# Altium schematic sheet HTMD-PREAMP2.SCHDOC: EMRT PRE-AMP
size A1; DocumentNumber: 9321-E-1210 EMRT PRE-AMP; Revision: 2.0; SheetNumber: 1; SheetTotal: 1; Author: CFB; DrawnBy: CFB; PageSetup: Record=PageOptions|CenterHorizontal=True|CenterVertical=True|PrintScale=0.52|XCorrection=1.00|YCorrection=1.00|PrintKind=1|BorderSize=5000000|LeftOffset=0|BottomOffset=0|Orientation=2|PaperLength=1000|PaperWidth=1000|Scale=100|PaperSource=15|PrintQuality=600|MediaType=1|DitherType=10|PaperKind=A3|PrintScaleMode=1
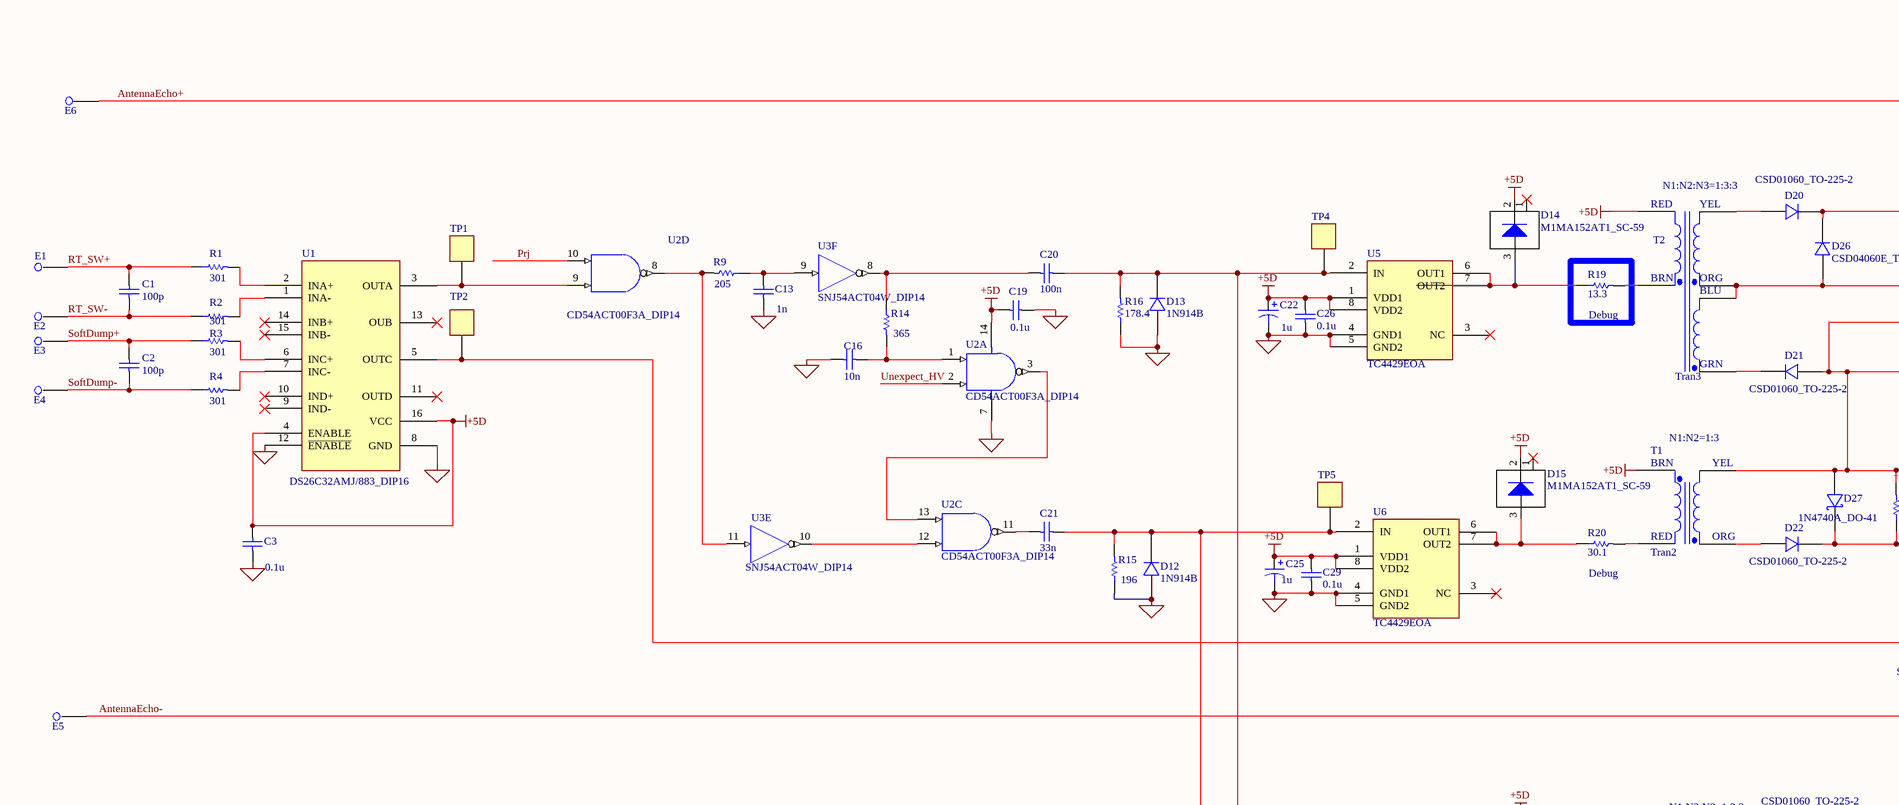
[diagram p0: HTMD-PREAMP2.SCHDOC, top left]
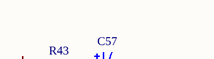
[diagram p1: HTMD-PREAMP2.SCHDOC, top right]
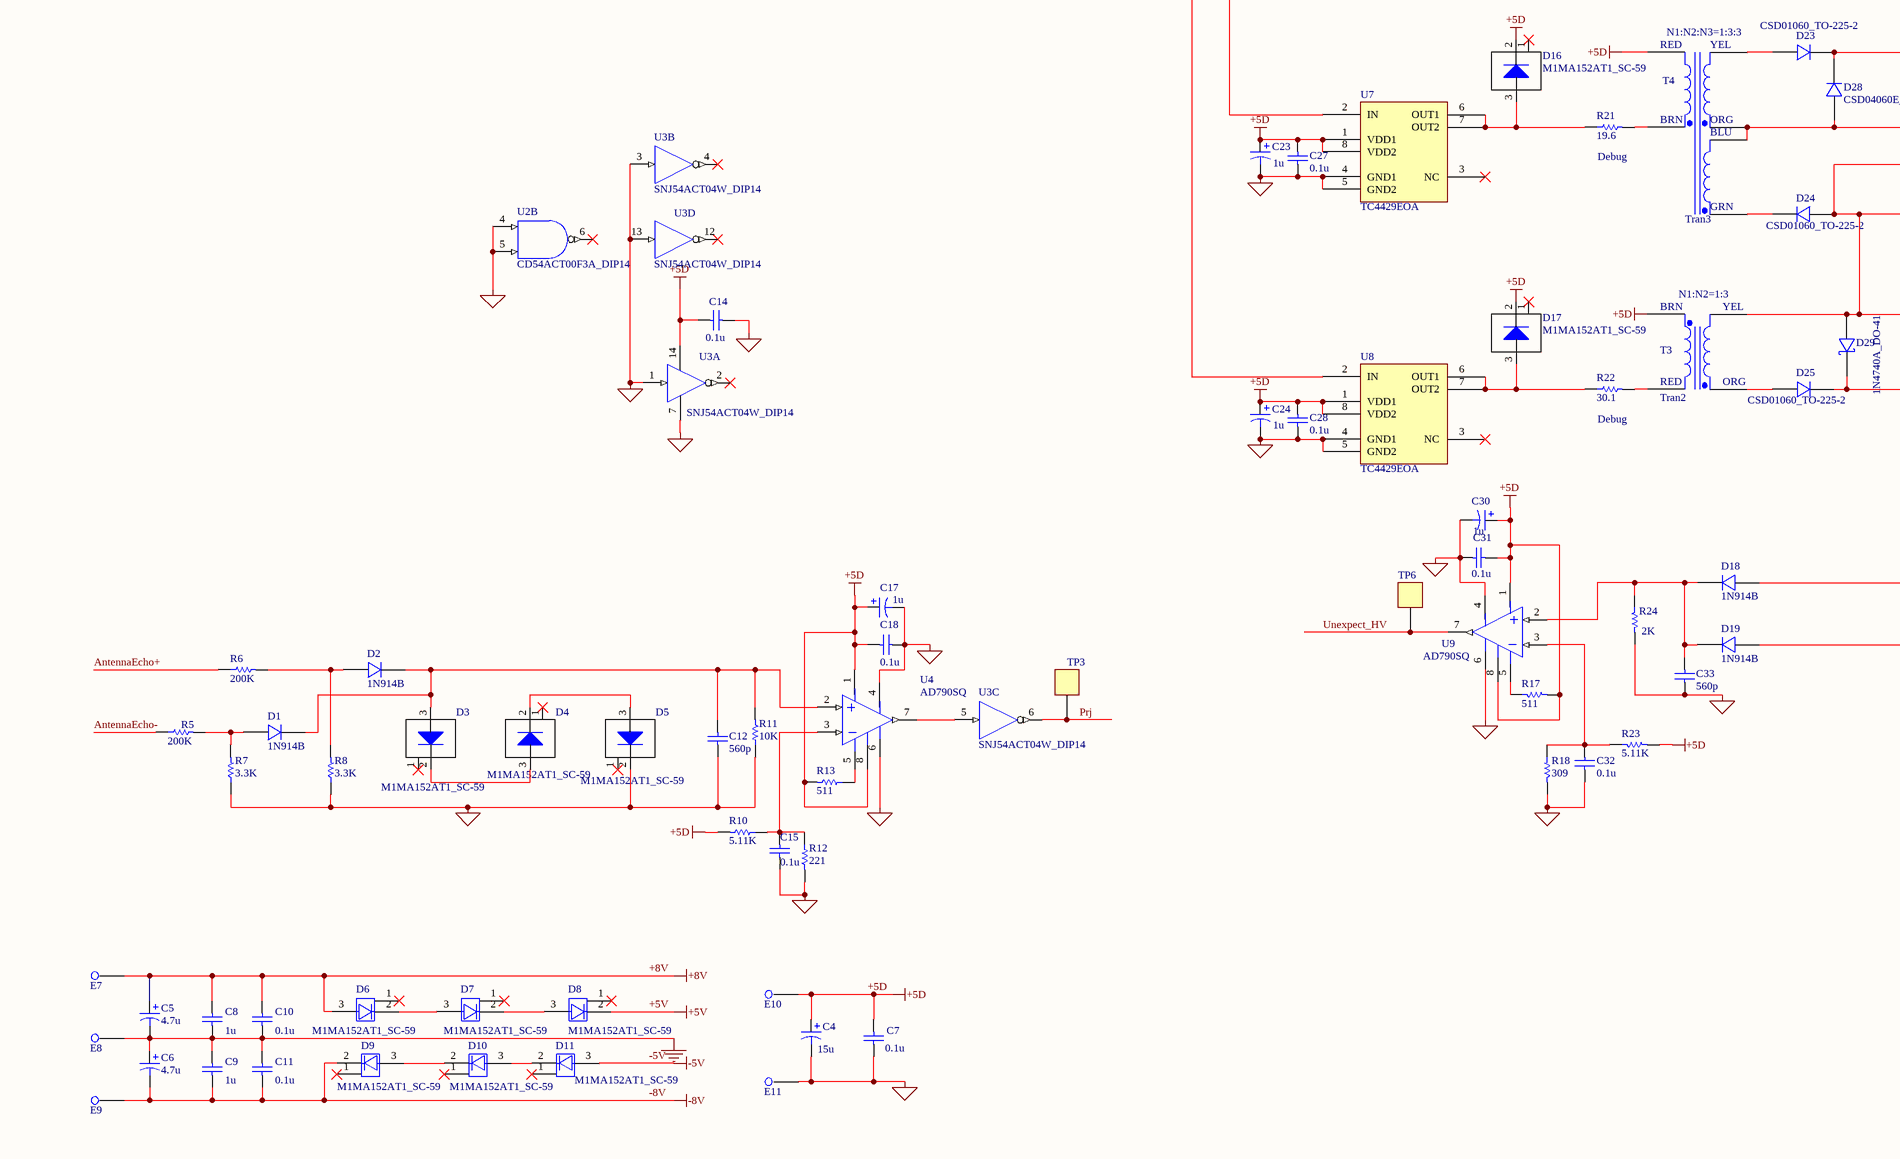
[diagram p2: HTMD-PREAMP2.SCHDOC, bottom left]
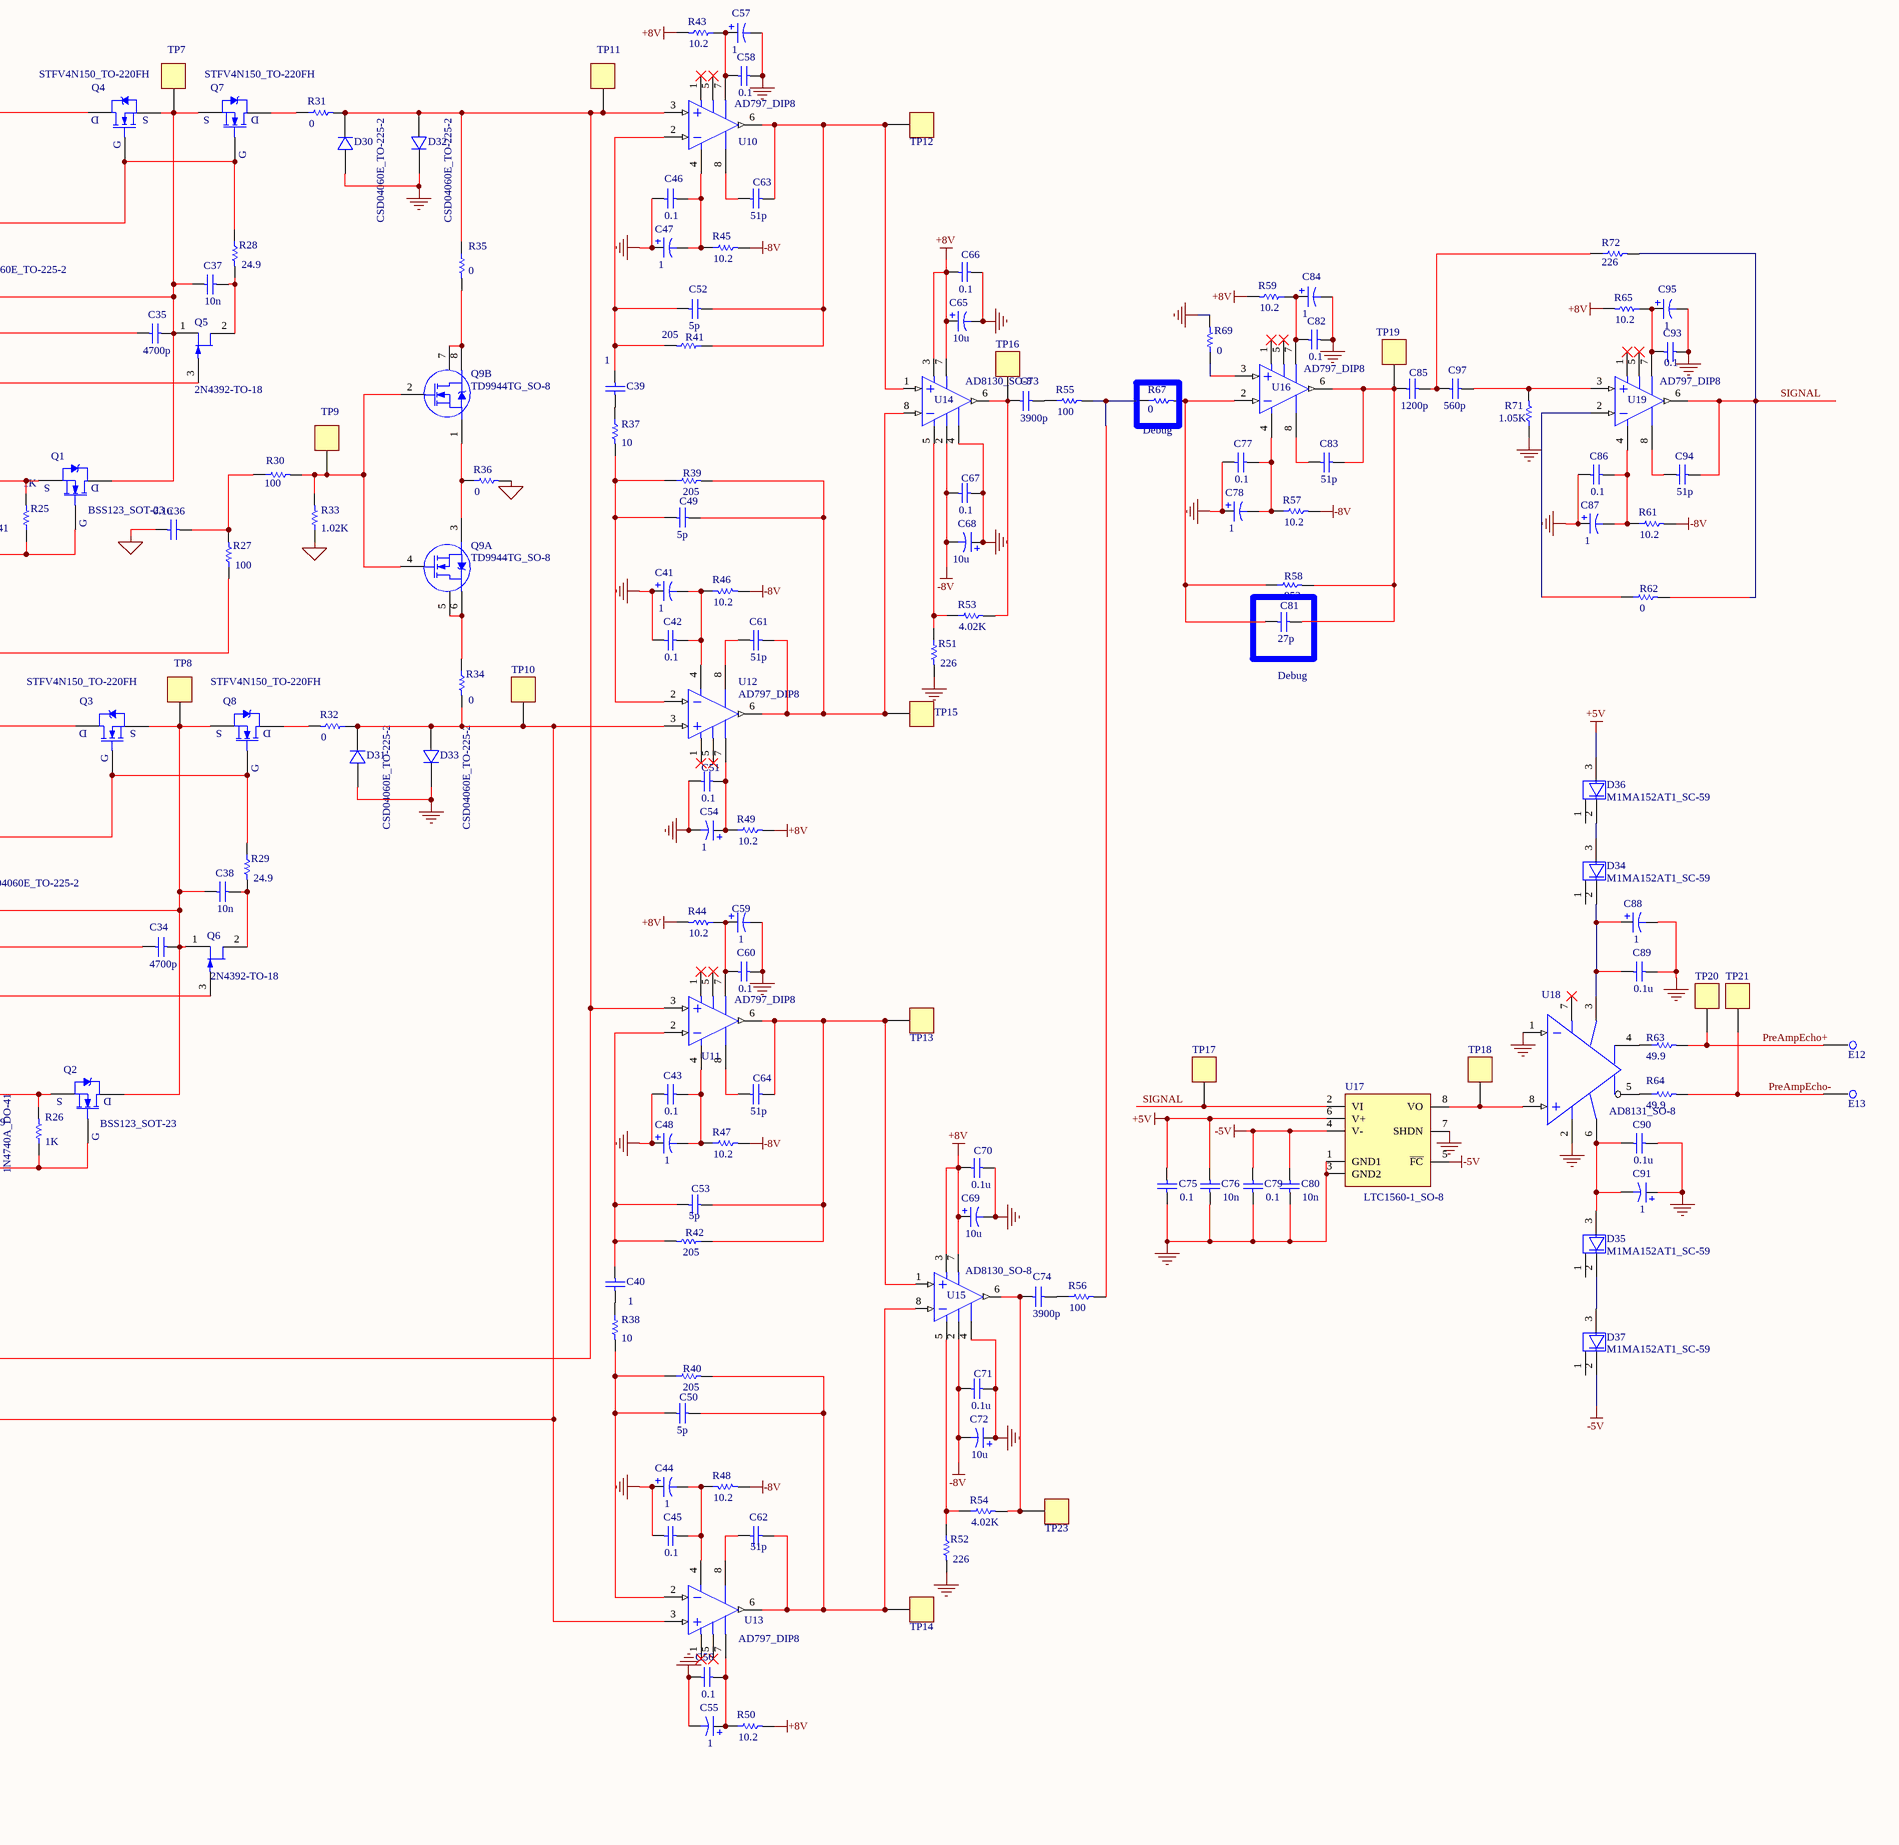
[diagram p3: HTMD-PREAMP2.SCHDOC, bottom right]

## Parts
C1  100p  [C0805]
C2  100p  [C0805]
C3  0.1u  [C0805]
C4  15u  [595D]
C5  4.7u  [595D]
C6  4.7u  [595D]
C7  0.1u  [C0805]
C8  1u  [1206]
C9  1u  [1206]
C10  0.1u  [C0805]
C11  0.1u  [C0805]
C12  560p  [C0805]
C13  1n  [1206]
C14  0.1u  [C0805]
C15  0.1u  [C0805]
C16  10n  [C0805]
C17  1u  [C1206]
C18  0.1u  [C0805]
C19  0.1u  [C0805]
C20  100n  [C0805]
C21  33n  [1206]
C22  1u  [C1206]
C23  1u  [C1206]
C24  1u  [C1206]
C25  1u  [C1206]
C26  0.1u  [C0805]
C27  0.1u  [C0805]
C28  0.1u  [C0805]
C29  0.1u  [C0805]
C30  1u  [C1206]
C31  0.1u  [C0805]
C32  0.1u  [C0805]
C33  560p  [C0805]
C34  4700p  [C0805]
C35  4700p  [C0805]
C36  0.1u  [C0805]
C37  10n  [1206]
C38  10n  [1206]
C39  1  [1206]
C40  1  [1206]
C41  1  [C1206]
C42  0.1  [C0805]
C43  0.1  [C0805]
C44  1  [C1206]
C45  0.1  [C0805]
C46  0.1  [C0805]
C47  1  [C1206]
C48  1  [C1206]
C49  5p  [C0805]
C50  5p  [C0805]
C51  0.1  [C0805]
C52  5p  [C0805]
C53  5p  [C0805]
C54  1  [C1206]
C55  1  [C1206]
C56  0.1  [C0805]
C57  1  [C1206]
C58  0.1  [C0805]
C59  1  [C1206]
C60  0.1  [C0805]
C61  51p  [C0805]
C62  51p  [C0805]
C63  51p  [C0805]
C64  51p  [C0805]
C65  10u  [7343]
C66  0.1  [C0805]
C67  0.1  [C0805]
C68  10u  [7343]
C69  10u  [7343]
C70  0.1u  [C0805]
C71  0.1u  [C0805]
C72  10u  [7343]
C73  3900p  [1206]
C74  3900p  [1206]
C75  0.1  [C0805]
C76  10n  [C0805]
C77  0.1  [C0805]
C78  1  [C1206]
C79  0.1  [C0805]
C80  10n  [C0805]
C81  27p  [C0805]
C82  0.1  [C0805]
C83  51p  [C0805]
C84  1  [C1206]
C85  1200p  [C0805]
C86  0.1  [C0805]
C87  1  [C1206]
C88  1  [C1206]
C89  0.1u  [C0805]
C90  0.1u  [C0805]
C91  1  [C1206]
C93  0.1  [C0805]
C94  51p  [C0805]
C95  1  [C1206]
C97  560p  [C0805]
D1  1N914B  [DO-35]
D2  1N914B  [DO-35]
D3  M1MA152AT1_SC-59  [SC-59]
D4  M1MA152AT1_SC-59  [SC-59]
D5  M1MA152AT1_SC-59  [SC-59]
D6  M1MA152AT1_SC-59  [SC-59]
D7  M1MA152AT1_SC-59  [SC-59]
D8  M1MA152AT1_SC-59  [SC-59]
D9  M1MA152AT1_SC-59  [SC-59]
D10  M1MA152AT1_SC-59  [SC-59]
D11  M1MA152AT1_SC-59  [SC-59]
D12  1N914B  [DO-35]
D13  1N914B  [DO-35]
D14  M1MA152AT1_SC-59  [SC-59]
D15  M1MA152AT1_SC-59  [SC-59]
D16  M1MA152AT1_SC-59  [SC-59]
D17  M1MA152AT1_SC-59  [SC-59]
D18  1N914B  [DO-35]
D19  1N914B  [DO-35]
D20  CSD01060_TO-225-2  [TO-225-2]
D21  CSD01060_TO-225-2  [TO-225-2]
D22  CSD01060_TO-225-2  [TO-225-2]
D23  CSD01060_TO-225-2  [TO-225-2]
D24  CSD01060_TO-225-2  [TO-225-2]
D25  CSD01060_TO-225-2  [TO-225-2]
D26  CSD04060E_TO-225-2  [TO-225-2]
D27  1N4740A_DO-41  [DO-41]
D28  CSD04060E_TO-225-2  [TO-225-2]
D29  1N4740A_DO-41  [DO-41]
D30  CSD04060E_TO-225-2  [TO-225-2]
D31  CSD04060E_TO-225-2  [TO-225-2]
D32  CSD04060E_TO-225-2  [TO-225-2]
D33  CSD04060E_TO-225-2  [TO-225-2]
D34  M1MA152AT1_SC-59  [SC-59]
D35  M1MA152AT1_SC-59  [SC-59]
D36  M1MA152AT1_SC-59  [SC-59]
D37  M1MA152AT1_SC-59  [SC-59]
E1  InOut  [TermSignal]  (value not drawn)
E2  InOut  [TermSignal]  (value not drawn)
E3  InOut  [TermSignal]  (value not drawn)
E4  InOut  [TermSignal]  (value not drawn)
E5  InOut  [TermSignal]  (value not drawn)
E6  InOut  [TermSignal]  (value not drawn)
E7  InOut  [TermPower]  (value not drawn)
E8  InOut  [TermPower]  (value not drawn)
E9  InOut  [TermPower]  (value not drawn)
E10  InOut  [TermPower]  (value not drawn)
E11  InOut  [TermPower]  (value not drawn)
E12  InOut  [TermSignal]  (value not drawn)
E13  InOut  [TermSignal]  (value not drawn)
Q1  BSS123_SOT-23  [SOT-23]
Q2  BSS123_SOT-23  [SOT-23]
Q3  STFV4N150_TO-220FH  [TO-220FH]
Q4  STFV4N150_TO-220FH  [TO-220FH]
Q5  2N4392-TO-18  [TO-18]
Q6  2N4392-TO-18  [TO-18]
Q7  STFV4N150_TO-220FH  [TO-220FH]
Q8  STFV4N150_TO-220FH  [TO-220FH]
Q9  TD9944TG_SO-8  [SO-8]  (parts A,B of 2)
R1  301  [R0805]
R2  301  [R0805]
R3  301  [R0805]
R4  301  [R0805]
R5  200K  [MG680]
R6  200K  [MG680]
R7  3.3K  [2010]
R8  3.3K  [2010]
R9  205  [R0805]
R10  5.11K  [R0805]
R11  10K  [R1206]
R12  221  [R0805]
R13  511  [R0805]
R14  365  [R0805]
R15  196  [R0805]
R16  178.4  [R0805]
R17  511  [R0805]
R18  309  [R0805]
R19  13.3  [R0805]
R20  30.1  [R0805]
R21  19.6  [R0805]
R22  30.1  [R0805]
R23  5.11K  [R0805]
R24  2K  [R1206]
R25  1K  [R0805]
R26  1K  [R0805]
R27  100  [R0805]
R28  24.9  [R0805]
R29  24.9  [R0805]
R30  100  [R0805]
R31  0  [R0805]
R32  0  [R0805]
R33  1.02K  [R0805]
R34  0  [R0805]
R35  0  [R0805]
R36  0  [R0805]
R37  10  [R0805]
R38  10  [R0805]
R39  205  [R0805]
R40  205  [R0805]
R41  205  [R0805]
R42  205  [R0805]
R43  10.2  [R0805]
R44  10.2  [R0805]
R45  10.2  [R0805]
R46  10.2  [R0805]
R47  10.2  [R0805]
R48  10.2  [R0805]
R49  10.2  [R0805]
R50  10.2  [R0805]
R51  226  [R0805]
R52  226  [R0805]
R53  4.02K  [R0805]
R54  4.02K  [R0805]
R55  100  [R0805]
R56  100  [R0805]
R57  10.2  [R0805]
R58  953  [R0805]
R59  10.2  [R0805]
R61  10.2  [R0805]
R62  0  [R0805]
R63  49.9  [R0805]
R64  49.9  [R0805]
R65  10.2  [R0805]
R67  0  [R0805]
R69  0  [R0805]
R71  1.05K  [R0805]
R72  226  [R0805]
T1  Tran2  [Tran2]
T2  Tran3  [Tran3]
T3  Tran2  [Tran2]
T4  Tran3  [Tran3]
TP1  TestPoint  [test_small]  (value not drawn)
TP2  TestPoint  [test_small]  (value not drawn)
TP3  TestPoint  [test_small]  (value not drawn)
TP4  TestPoint  [test_small]  (value not drawn)
TP5  TestPoint  [test_small]  (value not drawn)
TP6  TestPoint  [test_small]  (value not drawn)
TP7  TestPoint  [test_small]  (value not drawn)
TP8  TestPoint  [test_small]  (value not drawn)
TP9  TestPoint  [test_small]  (value not drawn)
TP10  TestPoint  [test_small]  (value not drawn)
TP11  TestPoint  [test_small]  (value not drawn)
TP12  TestPoint  [test_small]  (value not drawn)
TP13  TestPoint  [test_small]  (value not drawn)
TP14  TestPoint  [test_small]  (value not drawn)
TP15  TestPoint  [test_small]  (value not drawn)
TP16  TestPoint  [test_small]  (value not drawn)
TP17  TestPoint  [test_small]  (value not drawn)
TP18  TestPoint  [test_small]  (value not drawn)
TP19  TestPoint  [test_small]  (value not drawn)
TP20  TestPoint  [test_small]  (value not drawn)
TP21  TestPoint  [test_small]  (value not drawn)
TP23  TestPoint  [test_small]  (value not drawn)
U1  DS26C32AMJ/883_DIP16  [DIP16]
U2  CD54ACT00F3A_DIP14  [DIP14]  (parts A,B,C,D of 4)
U3  SNJ54ACT04W_DIP14  [DIP14]  (parts A,B,C,D,E,F of 6)
U4  AD790SQ  [DIP8]
U5  TC4429EOA  [SO-8]
U6  TC4429EOA  [SO-8]
U7  TC4429EOA  [SO-8]
U8  TC4429EOA  [SO-8]
U9  AD790SQ  [DIP8]
U10  AD797_DIP8  [DIP8]
U11  AD797_DIP8  [DIP8]
U12  AD797_DIP8  [DIP8]
U13  AD797_DIP8  [DIP8]
U14  AD8130_SO-8  [SO-8]
U15  AD8130_SO-8  [SO-8]
U16  AD797_DIP8  [DIP8]
U17  LTC1560-1_SO-8  [SO-8]
U18  AD8131_SO-8  [SO-8]
U19  AD797_DIP8  [DIP8]

## Blocks framed on the sheet
Debug: R19

## Nets
+5D: C3.1 C4.1 C7.2 C14.2 C17.1 C18.1 C19.2 C22.1 C23.1 C24.1 C25.1 C26.2 C27.2 C28.2 C29.2 C30.1 C31.1 D14.2 D15.2 D16.2 D17.2 E10.1(NC) R10.2 R13.2 R17.2 R23.2 T1.4(Pri-) T2.6(Pri+) T3.4(Pri-) T4.6(Pri+) U1.4(ENABLE) U1.16(VCC) U2.14(Vcc) U3.14(Vcc) U4.1(+Vs) U4.8(Vlogic) U5.1(VDD1) U5.8(VDD2) U6.1(VDD1) U6.8(VDD2) U7.1(VDD1) U7.8(VDD2) U8.1(VDD1) U8.8(VDD2) U9.1(+Vs) U9.8(Vlogic)
+5V: C75.1 C76.1 D8.2(K) D36.3(A) U17.6(V+)
+8V: C5.1 C8.1 C10.1 C65.1 C66.2 C69.1 C70.2 D6.3(A) E7.1(NC) R43.2 R44.2 R49.2 R50.2 R59.2 R65.2 U14.3(~{PD}) U14.7(+VS) U15.3(~{PD}) U15.7(+VS)
-5V: C79.1 C80.1 D11.3(A) D37.2(K) U17.4(V-) U17.5(~{FC})
-8V: C6.2 C9.2 C11.1 C67.2 C68.2 C71.2 C72.2 D9.2(K) E9.1(NC) R45.2 R46.2 R47.2 R48.2 R57.2 R61.2 U14.2(-VS) U15.2(-VS)
AGND: C5.2 C6.1 C8.2 C9.1 C10.2 C11.2 C41.1 C42.1 C43.1 C44.1 C45.2 C46.1 C47.1 C48.1 C51.2 C54.2 C55.2 C56.2 C57.2 C58.2 C59.2 C60.2 C65.2 C66.1 C67.1 C68.1 C69.2 C70.1 C71.1 C72.1 C75.2 C76.2 C77.1 C78.1 C79.2 C80.2 C82.2 C84.2 C86.1 C87.1 C88.2 C89.2 C90.1 C91.1 C93.2 C95.2 D30.2(A) D31.2(A) D32.1(K) D33.1(K) E8.1(NC) R51.2 R52.2 R69.2 R71.1 U14.4(REF) U15.4(REF) U17.1(GND1) U17.3(GND2) U17.7(SHDN) U18.1(Din-) U18.2(Vcom)
DGND: C3.2 C4.2 C7.1 C12.1 C13.2 C14.1 C15.1 C16.2 C17.2 C18.2 C19.1 C22.2 C23.2 C24.2 C25.2 C26.1 C27.1 C28.1 C29.1 C30.2 C31.2 C32.1 C33.1 C36.2 D5.2 D12.1(A) D13.1(A) E11.1(NC) R7.1 R8.1 R11.1 R12.2 R15.1 R16.1 R18.2 R24.2 R33.1 R36.2 U1.8(GND) U1.12(~{ENABLE}) U2.4(A) U2.5(B) U2.7(GND) U3.1(A) U3.3(A) U3.7(GND) U3.13(A) U4.4(-Vs) U4.6(GND) U5.4(GND1) U5.5(GND2) U6.4(GND1) U6.5(GND2) U7.4(GND1) U7.5(GND2) U8.4(GND1) U8.5(GND2) U9.4(-Vs) U9.6(GND)
AntennaEcho+: E6.1(NC) Q4.2(D) R6.1
AntennaEcho-: E5.1(NC) Q3.2(D) R5.1
PreAmpEcho+: E12.1(NC) R63.2 TP20.1(NC)
PreAmpEcho-: E13.1(NC) R64.2 TP21.1(NC)
Prj: TP3.1(NC) U2.10(A) U3.6(~{O})
RT_SW+: C1.2 E1.1(NC) R1.1
RT_SW-: C1.1 E2.1(NC) R2.1
SIGNAL: C94.1 R62.2 R72.2 TP17.1(NC) U17.2(VI) U19.6(OUTPUT)
SoftDump+: C2.2 E3.1(NC) R3.1
SoftDump-: C2.1 E4.1(NC) R4.1
Unexpect_HV: TP6.1(NC) U2.2(B) U9.7(OUT)
NetC12_2: C12.2 D1.2(K) D2.2(K) D3.3(A) R11.2 U4.2(IN+)
NetC13_1: C13.1 R9.1 U3.9(A)
NetC15_2: C15.2 R10.1 R12.1 U4.3(IN-)
NetC16_1: C16.1 R14.2 U2.1(A)
NetC20_1: C20.1 R14.1 U3.8(~{O})
NetC20_2: C20.2 D13.2(K) R16.2 TP4.1(NC) U5.2(IN) U7.2(IN)
NetC21_1: C21.1 U2.11(~{O})
NetC21_2: C21.2 D12.2(K) R15.2 TP5.1(NC) U6.2(IN) U8.2(IN)
NetC32_2: C32.2 R18.1 R23.1 U9.3(IN-)
NetC33_2: C33.2 D18.2(K) D19.2(K) R24.1 U9.2(IN+)
NetC34_1: C34.1 D24.2(A) D29.1(A) Q2.2(S) Q6.3(G) R26.2 T3.1(Sec+)
NetC34_2: C34.2 C38.1 D28.2(A) Q2.3(D) Q3.3(S) Q6.1(D) Q8.3(S) T4.2(Sec2+) T4.5(Sec1-) TP8.1(NC)
NetC35_1: C35.1 D21.2(A) D27.1(A) Q1.2(S) Q5.3(G) R25.2 T1.1(Sec+)
NetC35_2: C35.2 C37.1 D26.2(A) Q1.3(D) Q4.3(S) Q5.1(D) Q7.3(S) T2.2(Sec2+) T2.5(Sec1-) TP7.1(NC)
NetC36_1: C36.1 R27.2 R30.1
NetC37_2: C37.2 Q5.2(S) R28.2
NetC38_2: C38.2 Q6.2(S) R29.2
NetC39_1: C39.1 R37.1
NetC39_2: C39.2 C52.2 R41.2 U10.2(-IN)
NetC40_1: C40.1 R38.1
NetC40_2: C40.2 C53.2 R42.2 U11.2(-IN)
NetC41_2: C41.2 C42.2 R46.1 U12.4(-VS)
NetC43_2: C43.2 C48.2 R47.1 U11.4(-VS)
NetC44_2: C44.2 C45.1 R48.1 U13.4(-VS)
NetC46_2: C46.2 C47.2 R45.1 U10.4(-VS)
NetC49_1: C49.1 R37.2 R39.1 U12.2(-IN)
NetC49_2: C49.2 C61.1 R39.2 TP15.1(NC) U12.6(OUTPUT) U14.8(-IN)
NetC50_1: C50.1 R38.2 R40.1 U13.2(-IN)
NetC50_2: C50.2 C62.1 R40.2 TP14.1(NC) U13.6(OUTPUT) U15.8(-IN)
NetC51_1: C51.1 C54.1 R49.1 U12.7(NC)
NetC52_1: C52.1 C63.1 R41.1 TP12.1(NC) U10.6(OUTPUT) U14.1(+IN)
NetC53_1: C53.1 C64.1 R42.1 TP13.1(NC) U11.6(OUTPUT) U15.1(+IN)
NetC55_1: C55.1 C56.1 R50.1 U13.7(NC)
NetC57_1: C57.1 C58.1 R43.1 U10.7(NC)
NetC59_1: C59.1 C60.1 R44.1 U11.7(NC)
NetC61_2: C61.2 U12.8(NEU)
NetC62_2: C62.2 U13.8(NEU)
NetC63_2: C63.2 U10.8(NEU)
NetC64_2: C64.2 U11.8(NEU)
NetC73_1: C73.1 R55.1
NetC73_2: C73.2 R53.2 TP16.1(NC) U14.6(OUTPUT)
NetC74_1: C74.1 R56.1
NetC74_2: C74.2 R54.2 TP23.1(NC) U15.6(OUTPUT)
NetC77_2: C77.2 C78.2 R57.1 U16.4(-VS)
NetC81_1: C81.1 C83.1 C85.2 R58.2 TP19.1(NC) U16.6(OUTPUT)
NetC81_2: C81.2 R58.1 R67.2 U16.2(-IN)
NetC82_1: C82.1 C84.1 R59.1 U16.7(NC)
NetC83_2: C83.2 U16.8(NEU)
NetC85_1: C85.1 C97.1 R72.1
NetC86_2: C86.2 C87.2 R61.1 U19.4(-VS)
NetC88_1: C88.1 C89.1 D34.2(K) U18.3(V+)
NetC90_2: C90.2 C91.2 D35.3(A) U18.6(V-)
NetC93_1: C93.1 C95.1 R65.1 U19.7(NC)
NetC94_2: C94.2 U19.8(NEU)
NetC97_2: C97.2 R71.2 U19.3(+IN)
NetD1_1: D1.1(A) R5.2 R7.2
NetD2_1: D2.1(A) R6.2 R8.2
NetD3_2: D3.2 D4.3(A)
NetD4_2: D4.2 D5.3(A)
NetD6_2: D6.2(K) D7.3(A)
NetD7_2: D7.2(K) D8.3(A)
NetD9_3: D9.3(A) D10.2(K)
NetD10_3: D10.3(A) D11.2(K)
NetD14_3: D14.3(A) R19.1 U5.6(OUT1) U5.7(OUT2)
NetD15_3: D15.3(A) R20.1 U6.6(OUT1) U6.7(OUT2)
NetD16_3: D16.3(A) R21.1 U7.6(OUT1) U7.7(OUT2)
NetD17_3: D17.3(A) R22.1 U8.6(OUT1) U8.7(OUT2)
NetD18_1: D18.1(A) D30.1(K) D32.2(A) R31.2 R35.1 TP11.1(NC) U10.3(+IN) U11.3(+IN)
NetD19_1: D19.1(A) D31.1(K) D33.2(A) R32.1 R34.2 TP10.1(NC) U12.3(+IN) U13.3(+IN)
NetD20_1: D20.1(K) D26.1(K) Q4.1(G) Q7.1(G) R28.1
NetD20_2: D20.2(A) T2.4(Sec1+)
NetD21_1: D21.1(K) T2.3(Sec2-)
NetD22_1: D22.1(K) D27.2(K) Q1.1(G) R25.1
NetD22_2: D22.2(A) T1.2(Sec-)
NetD23_1: D23.1(K) D28.1(K) Q3.1(G) Q8.1(G) R29.1
NetD23_2: D23.2(A) T4.4(Sec1+)
NetD24_1: D24.1(K) T4.3(Sec2-)
NetD25_1: D25.1(K) D29.2(K) Q2.1(G) R26.1
NetD25_2: D25.2(A) T3.2(Sec-)
NetD34_3: D34.3(A) D36.2(K)
NetD35_2: D35.2(K) D37.3(A)
NetQ7_2: Q7.2(D) R31.1
NetQ8_2: Q8.2(D) R32.2
NetQ9_1: Q9.1(S) Q9.3(S) R36.1
NetQ9_2: Q9.2(G) Q9.4(G) R30.2 R33.2 TP9.1(NC)
NetQ9_5: Q9.5(D) Q9.6(D) R34.1
NetQ9_7: Q9.7(D) Q9.8(D) R35.2
NetR1_2: R1.2 U1.2(INA+)
NetR2_2: R2.2 U1.1(INA-)
NetR3_2: R3.2 U1.6(INC+)
NetR4_2: R4.2 U1.7(INC-)
NetR9_2: R9.2 U2.8(~{O}) U3.11(A)
NetR13_1: R13.1 U4.5(~{latch})
NetR17_1: R17.1 U9.5(~{latch})
NetR19_2: R19.2 T2.1(Pri-)
NetR20_2: R20.2 T1.3(Pri-)
NetR21_2: R21.2 T4.1(Pri-)
NetR22_2: R22.2 T3.3(Pri-)
NetR27_1: R27.1 TP2.1(NC) U1.5(OUTC)
NetR51_1: R51.1 R53.1 U14.5(FB)
NetR52_1: R52.1 R54.1 U15.5(FB)
NetR55_2: R55.2 R56.2 R67.1
NetR62_1: R62.1 U19.2(-IN)
NetR63_1: R63.1 U18.4(OUT+)
NetR64_1: R64.1 U18.5(OUT-)
NetR69_1: R69.1 U16.3(+IN)
NetTP1_1: TP1.1(NC) U1.3(OUTA) U2.9(B)
NetTP18_1: TP18.1(NC) U17.8(VO) U18.8(Din+)
NetU2_3: U2.3(~{O}) U2.13(A)
NetU2_12: U2.12(B) U3.10(~{O})
NetU3_5: U3.5(A) U4.7(OUT)

Not connected (* = marked no-connect by the designer): D3 1*; D4 1*; D5 1*; D6 1(NC)*; D7 1(NC)*; D8 1(NC)*; D9 1(NC)*; D10 1(NC)*; D11 1(NC)*; D14 1*; D15 1*; D16 1*; D17 1*; D34 1(NC); D35 1(NC); D36 1(NC); D37 1(NC); U1 9(IND-)* 10(IND+)* 11(OUTD)* 13(OUB)* 14(INB+)* 15(INB-)*; U2 6(~{O})*; U3 2(~{O})* 4(~{O})* 12(~{O})*; U5 3(NC)*; U6 3(NC)*; U7 3(NC)*; U8 3(NC)*; U10 1* 5(NC)*; U11 1* 5(NC)*; U12 1* 5(NC)*; U13 1* 5(NC)*; U16 1* 5(NC)*; U18 7(NC)*; U19 1* 5(NC)*

## Notes on the sheet
- (near T2) N1:N2:N3=1:3:3
- (near T1) N1:N2=1:3
- (near R67) Debug
- (near R20) Debug
- Debug
- (near T4) N1:N2:N3=1:3:3
- (near R21) Debug
- (near T3) N1:N2=1:3
- (near R22) Debug
- (in symbol Tran2) BRN; YEL; RED; ORG
- (in symbol Tran3) RED; YEL; BRN; ORG; BLU; GRN

## Library data of the parts
C1 C2 = Cap: Capacitor; Value: 100pF; Published: 8-Jun-2000; LatestRevisionDate: 17-Jul-2002; LatestRevisionNote: Re-released for DXP Platform.; PackageReference: C0805; Publisher: Altium Limited
C3 C7-C11 C13-C16 C18 C26-C29 C36-C40 C42 C43 C45 C46 C51 C56 C58 C60 C66 C67 C75 C77 C79 C82 C86 C89 C90 C93 = Cap: Capacitor; Published: 8-Jun-2000; LatestRevisionDate: 17-Jul-2002; LatestRevisionNote: Re-released for DXP Platform.; Publisher: Altium Limited
  C3 C10 C11 C14 C15 C18 C26-C29 C89 C90: PackageReference: RAD-0.3; Value: 0.1u
  C7 C36: PackageReference: C0805; Value: 0.1u
  C8 C9: PackageReference: RAD-0.3; Value: 1u
  C13: PackageReference: RAD-0.3; Value: 1n
  C16: PackageReference: RAD-0.3; Value: 10n
  C37 C38: PackageReference: C1206; Value: 10n
  C39 C40: PackageReference: RAD-0.3; Value: 1
  C42 C43 C45 C46 C51 C56 C58 C60 C66 C67 C75 C77 C79 C82 C86 C93: PackageReference: RAD-0.3; Value: 0.1
C4 = Cap Pol1: Polarized Capacitor (Radial); Value: 15uF; Published: 8-Jun-2000; LatestRevisionDate: 17-Jul-2002; LatestRevisionNote: Re-released for DXP Platform.; PackageReference: 7343; Publisher: Altium Limited
C5 C6 = Cap Pol1: Polarized Capacitor (Radial); Value: 4.7uF; Published: 8-Jun-2000; LatestRevisionDate: 17-Jul-2002; LatestRevisionNote: Re-released for DXP Platform.; PackageReference: C1210; Publisher: Altium Limited
C12 C33 = Cap: Capacitor; Value: 560pf; Published: 8-Jun-2000; LatestRevisionDate: 17-Jul-2002; LatestRevisionNote: Re-released for DXP Platform.; PackageReference: RAD-0.3; Publisher: Altium Limited
C17 C22-C25 C30 = Cap Pol1: Polarized Capacitor (Radial); Published: 8-Jun-2000; LatestRevisionDate: 17-Jul-2002; LatestRevisionNote: Re-released for DXP Platform.; PackageReference: RB7.6-15; Publisher: Altium Limited; Value: 1u
C19 C70 C71 = Cap: Capacitor; Value: 0.1uF; Published: 8-Jun-2000; LatestRevisionDate: 17-Jul-2002; LatestRevisionNote: Re-released for DXP Platform.; Publisher: Altium Limited
  C19: PackageReference: C0805
  C70 C71: PackageReference: RAD-0.3
C20 = Cap: Capacitor; Value: 100nF; Published: 8-Jun-2000; LatestRevisionDate: 17-Jul-2002; LatestRevisionNote: Re-released for DXP Platform.; PackageReference: RAD-0.3; Publisher: Altium Limited
C21 = Cap: Capacitor; Value: 33nF; Published: 8-Jun-2000; LatestRevisionDate: 17-Jul-2002; LatestRevisionNote: Re-released for DXP Platform.; PackageReference: RAD-0.3; Publisher: Altium Limited
C31 C32 = Cap: Capacitor; Value: 0.1uf; Published: 8-Jun-2000; LatestRevisionDate: 17-Jul-2002; LatestRevisionNote: Re-released for DXP Platform.; PackageReference: RAD-0.3; Publisher: Altium Limited
C34 C35 = Cap: Capacitor; Value: 4700pF; Published: 8-Jun-2000; LatestRevisionDate: 17-Jul-2002; LatestRevisionNote: Re-released for DXP Platform.; PackageReference: C0805; Publisher: Altium Limited
C41 C44 C47 C48 C54 C55 C57 C59 C78 C84 C87 C88 C91 C95 = Cap Pol3: Polarized Capacitor (Surface Mount); Published: 8-Jun-2000; LatestRevisionDate: 17-Jul-2002; LatestRevisionNote: Re-released for DXP Platform.; PackageReference: C0805; Publisher: Altium Limited; Value: 1
C49 C50 C52 C53 = Cap: Capacitor; Value: 5pF; Published: 8-Jun-2000; LatestRevisionDate: 17-Jul-2002; LatestRevisionNote: Re-released for DXP Platform.; Publisher: Altium Limited
  C49 C50 C53: PackageReference: RAD-0.3
  C52: PackageReference: C0805
C61-C64 C83 C94 = Cap: Capacitor; Value: 51pF; Published: 8-Jun-2000; LatestRevisionDate: 17-Jul-2002; LatestRevisionNote: Re-released for DXP Platform.; PackageReference: RAD-0.3; Publisher: Altium Limited
C65 C68 C69 C72 = Cap Pol3: Polarized Capacitor (Surface Mount); Value: 10uF; Published: 8-Jun-2000; LatestRevisionDate: 17-Jul-2002; LatestRevisionNote: Re-released for DXP Platform.; PackageReference: C0805; Publisher: Altium Limited
C73 C74 = Cap: Capacitor; Value: 3900pF; Published: 8-Jun-2000; LatestRevisionDate: 17-Jul-2002; LatestRevisionNote: Re-released for DXP Platform.; PackageReference: RAD-0.3; Publisher: Altium Limited
C76 C80 = Cap: Capacitor; Value: 10nF; Published: 8-Jun-2000; LatestRevisionDate: 17-Jul-2002; LatestRevisionNote: Re-released for DXP Platform.; PackageReference: RAD-0.3; Publisher: Altium Limited
C81 = Cap: Capacitor; Value: 27pF; Published: 8-Jun-2000; LatestRevisionDate: 17-Jul-2002; LatestRevisionNote: Re-released for DXP Platform.; PackageReference: RAD-0.3; Publisher: Altium Limited
C85 = Cap: Capacitor; Value: 1200pF; Published: 8-Jun-2000; LatestRevisionDate: 17-Jul-2002; LatestRevisionNote: Re-released for DXP Platform.; PackageReference: C0805; Publisher: Altium Limited
C97 = Cap: Capacitor; Value: 560pF; Published: 8-Jun-2000; LatestRevisionDate: 17-Jul-2002; LatestRevisionNote: Re-released for DXP Platform.; PackageReference: RAD-0.3; Publisher: Altium Limited
D3-D5 = M1MA152AT1: single silicon switching diodes; Published: 8-Jun-2000; LatestRevisionDate: 17-Jul-2002; LatestRevisionNote: Re-released for DXP Platform.; PackageDocument: Sep-1996; PackageReference: SMC; Publisher: Altium Limited; Code_JEDEC: DO-214-AB
D6-D11 D34-D37 = M1MA152AT1
D14-D17 = M1MA152AT1_1: single silicon switching diodes; Published: 8-Jun-2000; LatestRevisionDate: 17-Jul-2002; LatestRevisionNote: Re-released for DXP Platform.; PackageDocument: Sep-1996; PackageReference: SMC; Publisher: Altium Limited; Code_JEDEC: DO-214-AB
D20-D25 = CSD01060
D26 D28 D30-D33 = CSD04060E
D27 D29 = 1N4740A: Schottky Rectifier
Q1 Q2 = BSS123
Q3 Q4 Q7 Q8 = STFV4N150
Q5 Q6 = MPF4392
Q9 = TD9944
R1-R59 R61-R65 R67 R69 R71 R72 = Res1: Resistor; Published: 8-Jun-2000; LatestRevisionDate: 17-Jul-2002; LatestRevisionNote: Re-released for DXP Platform.; Publisher: Altium Limited
  R1-R4: PackageReference: AXIAL-0.3; Value: 301
  R5 R6: PackageReference: AXIAL-0.3; Value: 200K
  R7 R8: PackageReference: AXIAL-0.3; Value: 3.3K
  R9 R39-R42: PackageReference: AXIAL-0.3; Value: 205
  R10 R23: PackageReference: AXIAL-0.3; Value: 5.11K
  R11: PackageReference: AXIAL-0.3; Value: 10k
  R12: PackageReference: AXIAL-0.3; Value: 221
  R13 R17: PackageReference: AXIAL-0.3; Value: 511
  R14: PackageReference: AXIAL-0.3; Value: 365
  R15: PackageReference: AXIAL-0.3; Value: 196
  R16: PackageReference: AXIAL-0.3; Value: 178.4
  R18: PackageReference: AXIAL-0.3; Value: 309
  R19: PackageReference: R0805; Value: 13.3
  R20 R22: PackageReference: R0805; Value: 30.1
  R21: PackageReference: R0805; Value: 19.6
  R24: PackageReference: AXIAL-0.3; Value: 2K
  R25 R26: PackageReference: R0805; Value: 1K
  R27 R30: PackageReference: R0805; Value: 100
  R28 R29: PackageReference: AXIAL-0.3; Value: 24.9
  R31 R34-R36: PackageReference: R0805; Value: 0
  R32 R62 R67 R69: PackageReference: AXIAL-0.3; Value: 0
  R33: PackageReference: R0805; Value: 1.02K
  R37: PackageReference: R0805; Value: 10
  R38: PackageReference: AXIAL-0.3; Value: 10
  R43-R46 R49 R57 R59 R61 R65: PackageReference: AXIAL-0.3; Value: 10.2
  R47 R48 R50: PackageReference: R0805; Value: 10.2
  R51 R52 R72: PackageReference: AXIAL-0.3; Value: 226
  R53 R54: PackageReference: AXIAL-0.3; Value: 4.02K
  R55 R56: PackageReference: AXIAL-0.3; Value: 100
  R58: PackageReference: AXIAL-0.3; Value: 953
  R63 R64: PackageReference: R0805; Value: 49.9
  R71: PackageReference: AXIAL-0.3; Value: 1.05K
U1 = DS26LV32AM
U2 = SNJ54ACT00W
U3 = SNJ54ACT04W: Hex Inverter
U4 U9 = AD790SQ: fast,precision comparator; Published: 8-Jun-2000; LatestRevisionDate: 04-Mar-2005; LatestRevisionNote: Stylized 3D Model Added.; DatasheetVersion: 1992; PackageVersion: 1998; PackageReference: Q-8; Publisher: Altium Limited; PackageDescription: DIP; 8 Leads; Row Spacing 7.62 mm; Pitch 2.54 mm; ComponentLink1Description: Manufacturer Link; ComponentLink1URL: http://www.analog.com/
U10-U13 U16 U19 = AD797
U14 U15 = AD8130: AD8130: *
U17 = LTC1560
U18 = AD8131